# Altium schematic sheet sb-sonata-expandheader.SchDoc: Expansion pin headers
size Letter; Organization: NewAE Technology Inc.; Address1: 1083 Queen St., Suite 196; Address2: Halifax; Address3: NS; Address4: Canada B3H 0B2; DocumentNumber: .; Revision: .; SheetNumber: 21; SheetTotal: 22; SheetApproved: NO
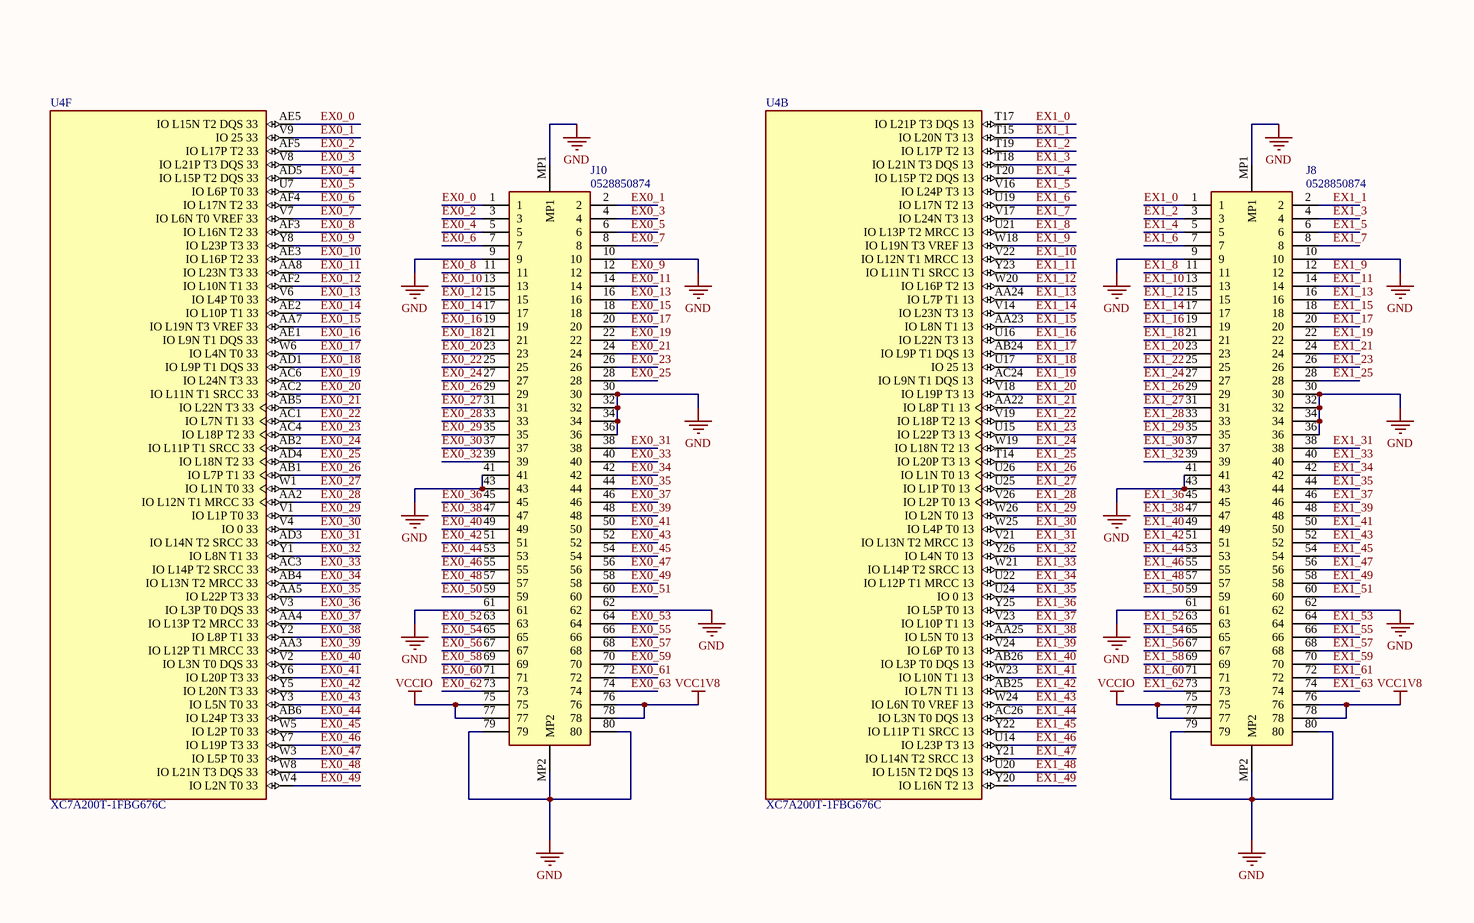
[diagram p0: sb-sonata-expandheader.SchDoc, right]

## Parts
J8  0528850874  [0528850874]
J10  0528850874  [0528850874]
U4  XC7A200T-1FBG676C  [FP-XC7A200T-1FBG676C-MFG]  (parts B,F of 14)

## Nets
GND: J8.9 J8.10 J8.30 J8.32 J8.34 J8.36 J8.41 J8.43 J8.61 J8.62 J8.79 J8.80 J8.MP1 J8.MP2 J10.9 J10.10 J10.30 J10.32 J10.34 J10.36 J10.41 J10.43 J10.61 J10.62 J10.79 J10.80 J10.MP1 J10.MP2
VCC1V8: J8.76 J8.78 J10.76 J10.78
VCCIO: J8.75 J8.77 J10.75 J10.77
EX0_0: J10.1 U4.AE5(IO_L15N_T2_DQS_33)
EX0_1: J10.2 U4.V9(IO_25_33)
EX0_2: J10.3 U4.AF5(IO_L17P_T2_33)
EX0_3: J10.4 U4.V8(IO_L21P_T3_DQS_33)
EX0_4: J10.5 U4.AD5(IO_L15P_T2_DQS_33)
EX0_5: J10.6 U4.U7(IO_L6P_T0_33)
EX0_6: J10.7 U4.AF4(IO_L17N_T2_33)
EX0_7: J10.8 U4.V7(IO_L6N_T0_VREF_33)
EX0_8: J10.11 U4.AF3(IO_L16N_T2_33)
EX0_9: J10.12 U4.Y8(IO_L23P_T3_33)
EX0_10: J10.13 U4.AE3(IO_L16P_T2_33)
EX0_11: J10.14 U4.AA8(IO_L23N_T3_33)
EX0_12: J10.15 U4.AF2(IO_L10N_T1_33)
EX0_13: J10.16 U4.V6(IO_L4P_T0_33)
EX0_14: J10.17 U4.AE2(IO_L10P_T1_33)
EX0_15: J10.18 U4.AA7(IO_L19N_T3_VREF_33)
EX0_16: J10.19 U4.AE1(IO_L9N_T1_DQS_33)
EX0_17: J10.20 U4.W6(IO_L4N_T0_33)
EX0_18: J10.21 U4.AD1(IO_L9P_T1_DQS_33)
EX0_19: J10.22 U4.AC6(IO_L24N_T3_33)
EX0_20: J10.23 U4.AC2(IO_L11N_T1_SRCC_33)
EX0_21: J10.24 U4.AB5(IO_L22N_T3_33)
EX0_22: J10.25 U4.AC1(IO_L7N_T1_33)
EX0_23: J10.26 U4.AC4(IO_L18P_T2_33)
EX0_24: J10.27 U4.AB2(IO_L11P_T1_SRCC_33)
EX0_25: J10.28 U4.AD4(IO_L18N_T2_33)
EX0_26: J10.29 U4.AB1(IO_L7P_T1_33)
EX0_27: J10.31 U4.W1(IO_L1N_T0_33)
EX0_28: J10.33 U4.AA2(IO_L12N_T1_MRCC_33)
EX0_29: J10.35 U4.V1(IO_L1P_T0_33)
EX0_30: J10.37 U4.V4(IO_0_33)
EX0_31: J10.38 U4.AD3(IO_L14N_T2_SRCC_33)
EX0_32: J10.39 U4.Y1(IO_L8N_T1_33)
EX0_33: J10.40 U4.AC3(IO_L14P_T2_SRCC_33)
EX0_34: J10.42 U4.AB4(IO_L13N_T2_MRCC_33)
EX0_35: J10.44 U4.AA5(IO_L22P_T3_33)
EX0_36: J10.45 U4.V3(IO_L3P_T0_DQS_33)
EX0_37: J10.46 U4.AA4(IO_L13P_T2_MRCC_33)
EX0_38: J10.47 U4.Y2(IO_L8P_T1_33)
EX0_39: J10.48 U4.AA3(IO_L12P_T1_MRCC_33)
EX0_40: J10.49 U4.V2(IO_L3N_T0_DQS_33)
EX0_41: J10.50 U4.Y6(IO_L20P_T3_33)
EX0_42: J10.51 U4.Y5(IO_L20N_T3_33)
EX0_43: J10.52 U4.Y3(IO_L5N_T0_33)
EX0_44: J10.53 U4.AB6(IO_L24P_T3_33)
EX0_45: J10.54 U4.W5(IO_L2P_T0_33)
EX0_46: J10.55 U4.Y7(IO_L19P_T3_33)
EX0_47: J10.56 U4.W3(IO_L5P_T0_33)
EX0_48: J10.57 U4.W8(IO_L21N_T3_DQS_33)
EX0_49: J10.58 U4.W4(IO_L2N_T0_33)
EX0_50: J10.59
EX0_51: J10.60
EX0_52: J10.63
EX0_53: J10.64
EX0_54: J10.65
EX0_55: J10.66
EX0_56: J10.67
EX0_57: J10.68
EX0_58: J10.69
EX0_59: J10.70
EX0_60: J10.71
EX0_61: J10.72
EX0_62: J10.73
EX0_63: J10.74
EX1_0: J8.1 U4.T17(IO_L21P_T3_DQS_13)
EX1_1: J8.2 U4.T15(IO_L20N_T3_13)
EX1_2: J8.3 U4.T19(IO_L17P_T2_13)
EX1_3: J8.4 U4.T18(IO_L21N_T3_DQS_13)
EX1_4: J8.5 U4.T20(IO_L15P_T2_DQS_13)
EX1_5: J8.6 U4.V16(IO_L24P_T3_13)
EX1_6: J8.7 U4.U19(IO_L17N_T2_13)
EX1_7: J8.8 U4.V17(IO_L24N_T3_13)
EX1_8: J8.11 U4.U21(IO_L13P_T2_MRCC_13)
EX1_9: J8.12 U4.W18(IO_L19N_T3_VREF_13)
EX1_10: J8.13 U4.V22(IO_L12N_T1_MRCC_13)
EX1_11: J8.14 U4.Y23(IO_L11N_T1_SRCC_13)
EX1_12: J8.15 U4.W20(IO_L16P_T2_13)
EX1_13: J8.16 U4.AA24(IO_L7P_T1_13)
EX1_14: J8.17 U4.V14(IO_L23N_T3_13)
EX1_15: J8.18 U4.AA23(IO_L8N_T1_13)
EX1_16: J8.19 U4.U16(IO_L22N_T3_13)
EX1_17: J8.20 U4.AB24(IO_L9P_T1_DQS_13)
EX1_18: J8.21 U4.U17(IO_25_13)
EX1_19: J8.22 U4.AC24(IO_L9N_T1_DQS_13)
EX1_20: J8.23 U4.V18(IO_L19P_T3_13)
EX1_21: J8.24 U4.AA22(IO_L8P_T1_13)
EX1_22: J8.25 U4.V19(IO_L18P_T2_13)
EX1_23: J8.26 U4.U15(IO_L22P_T3_13)
EX1_24: J8.27 U4.W19(IO_L18N_T2_13)
EX1_25: J8.28 U4.T14(IO_L20P_T3_13)
EX1_26: J8.29 U4.U26(IO_L1N_T0_13)
EX1_27: J8.31 U4.U25(IO_L1P_T0_13)
EX1_28: J8.33 U4.V26(IO_L2P_T0_13)
EX1_29: J8.35 U4.W26(IO_L2N_T0_13)
EX1_30: J8.37 U4.W25(IO_L4P_T0_13)
EX1_31: J8.38 U4.V21(IO_L13N_T2_MRCC_13)
EX1_32: J8.39 U4.Y26(IO_L4N_T0_13)
EX1_33: J8.40 U4.W21(IO_L14P_T2_SRCC_13)
EX1_34: J8.42 U4.U22(IO_L12P_T1_MRCC_13)
EX1_35: J8.44 U4.U24(IO_0_13)
EX1_36: J8.45 U4.Y25(IO_L5P_T0_13)
EX1_37: J8.46 U4.V23(IO_L10P_T1_13)
EX1_38: J8.47 U4.AA25(IO_L5N_T0_13)
EX1_39: J8.48 U4.V24(IO_L6P_T0_13)
EX1_40: J8.49 U4.AB26(IO_L3P_T0_DQS_13)
EX1_41: J8.50 U4.W23(IO_L10N_T1_13)
EX1_42: J8.51 U4.AB25(IO_L7N_T1_13)
EX1_43: J8.52 U4.W24(IO_L6N_T0_VREF_13)
EX1_44: J8.53 U4.AC26(IO_L3N_T0_DQS_13)
EX1_45: J8.54 U4.Y22(IO_L11P_T1_SRCC_13)
EX1_46: J8.55 U4.U14(IO_L23P_T3_13)
EX1_47: J8.56 U4.Y21(IO_L14N_T2_SRCC_13)
EX1_48: J8.57 U4.U20(IO_L15N_T2_DQS_13)
EX1_49: J8.58 U4.Y20(IO_L16N_T2_13)
EX1_50: J8.59
EX1_51: J8.60
EX1_52: J8.63
EX1_53: J8.64
EX1_54: J8.65
EX1_55: J8.66
EX1_56: J8.67
EX1_57: J8.68
EX1_58: J8.69
EX1_59: J8.70
EX1_60: J8.71
EX1_61: J8.72
EX1_62: J8.73
EX1_63: J8.74

## Notes on the sheet
- Title:
- Date:
- Rev:
- Time:
- Project:
- Sheet
- of
- License:
- Copyright © NewAE Technology Inc.
- Approved:
- NewAE.com
- File:

## Library data of the parts
J8 J10 = 0528850874: Connector; Manufacturer_Name: Molex; Datasheet Link: https://www.molex.com/pdm_docs/sd/528850874_sd.pdf; Height: 4.2mm; Manufacturer_Part_Number: 0528850874; Arrow Part Number: 0528850874; Arrow Price/Stock: https://www.arrow.com/en/products/0528850874/molex
U4 = CMP-0364-00015-4: IC FPGA 400 I/O 676FCBGA; Manufacturer: Xilinx; Min Supply Voltage: 0.95V; Number Of Logic Elements Cells: 215360; Ciiva Ids: 8919048; Memory Type: DDR3; Max Supply Voltage: 1.05V; Number Of Registers: 269200; Number Of I/Os: 500; Max Junction Temp: +85°C; Ram Size: 13455360bits; Number Of Logic Blocks: 16825; Standoff Height: 0.4mm; Speed Grade: 1; Import Ts: 1521861070; Memory Size: 1GBytes; Lead Free: Yes; Height: 2.54mm; Octopart: https://octopart.com/xc7a200t-1fbg676c-xilinx-27810760; Ipc Land Pattern Name: BGA676C100P26X26_2700X2700X234; Manufacturer Part Number: XC7A200T-1FBG676C; Package: 0; Device Class L1: Integrated Circuits (ICs); Device Class L3: FPGAs - Field Programmable Gate Arrays; Temperature: 0°C to +85°C; Release Date: 1402465632; Temperature Range High: +85°C; Device Class L2: Embedded Processors and Controllers; RoHS: TRUE; ComponentLink2URL: https://www.xilinx.com/support/documentation/data_sheets/ds181_Artix_7_Data_Sheet.pdf; Temperature Range Low: 0°C; Digikey Description: IC FPGA 400 I/O 676FCBGA; Footprint Url: https://www.xilinx.com/support/documentation/user_guides/ug475_7Series_Pkg_Pinout.pdf; Automotive: No; Category: IC; ComponentLink2Description: Datasheet